# Altium project JacdacTopologyHubEc30 126.PrjPCB
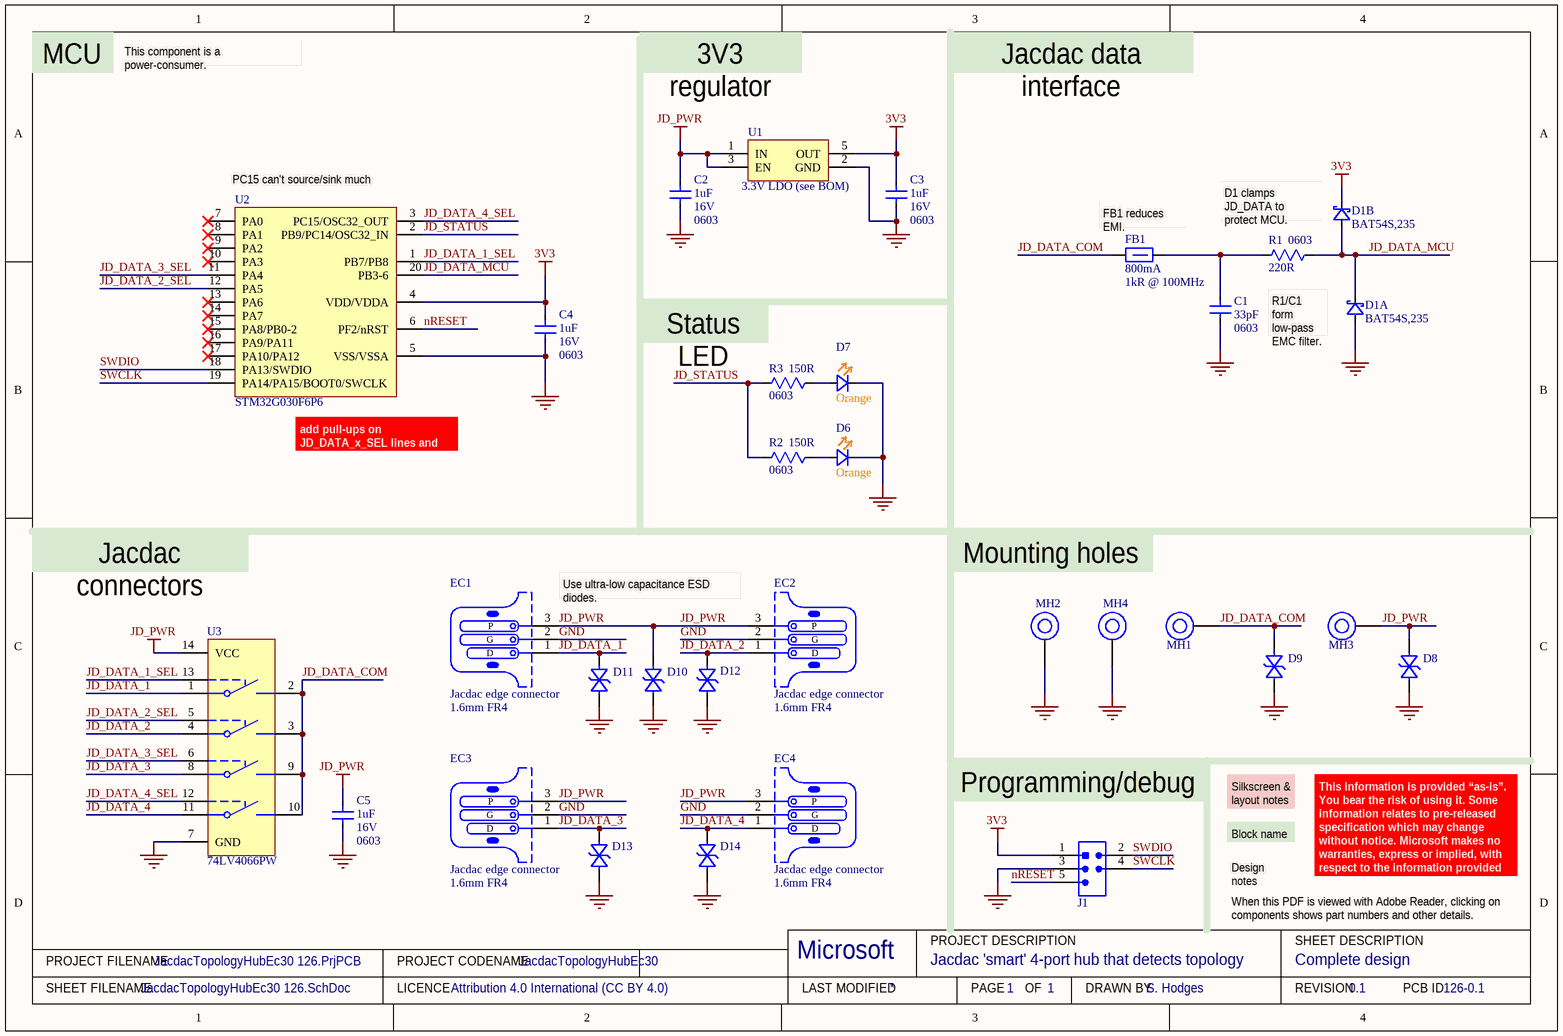
[diagram p0: JacdacTopologyHubEc30 126.SchDoc]
ProjectCodeName: JacdacTopologyHubEc30; ProjectCodenameDescription: Jacdac 'smart' 4-port hub that detects topology; ProjectCodenameID: 126; ProjectDrawnBy: S. Hodges; ProjectLicenceTerms: Attribution 4.0 International (CC BY 4.0); ProjectRevision: 0.1
1 sheet, 31 parts. Net scope: global (net labels, ports and power ports of the same name join across sheets).
Board file: JacdacTopologyHubEc30 126.PcbDoc

## Sheet JacdacTopologyHubEc30 126.SchDoc: Complete design
size A4; DrawnBy: S. Hodges; DocumentNumber: 1; Revision: 0.1; SheetNumber: 1; SheetTotal: 1; VersionControl_RevNumber: 1

### Parts
C1  Case/Package: 0603  [CC0603]  (hidden comment: 33pF)
C2  Voltage: 16V  Case/Package: 0603  Capacitance: 1uF  [C0603 - without outline]  (hidden comment: 1uF 16V)
C3  Voltage: 16V  Case/Package: 0603  Capacitance: 1uF  [C0603 - without outline]  (hidden comment: 1uF 16V)
C4  Voltage: 16V  Case/Package: 0603  Capacitance: 1uF  [C0603 - without outline]  (hidden comment: 1uF 16V)
C5  Voltage: 16V  Case/Package: 0603  Capacitance: 1uF  [C0603 - without outline]  (hidden comment: 1uF 16V)
D1  Manufacturer Part Number: BAT54S,235  [NXP-BAT54S-TO-236AB - without outline]  (hidden comment: BAT54S)  (parts A,B of 2)
D6  Colour: Orange  [0603 Orange]  (hidden comment: 19-217/S2C-AQ1R1B/3T)
D7  Colour: Orange  [0603 Orange]  (hidden comment: 19-217/S2C-AQ1R1B/3T)
D8  RCLAMP0521P-N  [TVS 0402 - XL]  (value not drawn)
D9  RCLAMP0521P-N  [TVS 0402 - XL]  (value not drawn)
D10  RCLAMP0521P-N  [TVS 0402 - XL]  (value not drawn)
D11  RCLAMP0521P-N  [TVS 0402 - XL]  (value not drawn)
D12  RCLAMP0521P-N  [TVS 0402 - XL]  (value not drawn)
D13  RCLAMP0521P-N  [TVS 0402 - XL]  (value not drawn)
D14  RCLAMP0521P-N  [TVS 0402 - XL]  (value not drawn)
EC1  Jacdac edge connector  PCB Type: 1.6mm FR4  [JACDAC_EDGE_CONNECTOR_TRACES_0.15MM]  (no BOM)
EC2  Jacdac edge connector  PCB Type: 1.6mm FR4  [JACDAC_EDGE_CONNECTOR_TRACES_0.15MM]  (no BOM)
EC3  Jacdac edge connector  PCB Type: 1.6mm FR4  [JACDAC_EDGE_CONNECTOR_TRACES_0.15MM]  (no BOM)
EC4  Jacdac edge connector  PCB Type: 1.6mm FR4  [JACDAC_EDGE_CONNECTOR_TRACES_0.15MM]  (no BOM)
FB1  Current Rating: 800mA  Impedance: 1kR @ 100MHz  [TDK MPZ1608 0.8mm - without outline]  (hidden comment: TDK MPZ1608S102ATA00)
J1  Hack Connect Mini 1.27 mm pitch 2-row  [HACK_CONNECT_MINI_5_X_1_27]  (value not drawn)
MH1  MH_6.5MMK_4.5MMC_3.0MMD_PTH  [MH_6.5MMK_4.5MMC_3.0MMD_PTH]  (value not drawn)  (no BOM)
MH2  MH_6.5MMK_4.5MMC_3.0MMD_PTH  [MH_6.5MMK_4.5MMC_3.0MMD_PTH]  (value not drawn)  (no BOM)
MH3  MH_6.5MMK_4.5MMC_3.0MMD_PTH  [MH_6.5MMK_4.5MMC_3.0MMD_PTH]  (value not drawn)  (no BOM)
MH4  MH_6.5MMK_4.5MMC_3.0MMD_PTH  [MH_6.5MMK_4.5MMC_3.0MMD_PTH]  (value not drawn)  (no BOM)
R1  Case/Package: 0603  [RC0603]  (hidden comment: 220R)
R2  Case/Package: 0603  [RC0603]  (hidden comment: 150R)
R3  Case/Package: 0603  [RC0603]  (hidden comment: 150R)
U1  3.3V LDO (see BOM)  [MICRONE-SOT23-5]
U2  STM32G030F6P6  [20-TSSOP - WITHOUT OUTLINE]
U3  (no value)  [TSSOP-14]

### Nets
3V3: C3.2 C4.2 D1.2(K) J1.1(VCC) U1.5(OUT) U2.4(VDD/VDDA)
GND: C1.1 C2.1 C3.1 C4.1 C5.1 D1.1(A) D6.1(K) D7.1(K) D8.2(A) D9.2(A) D10.2(A) D11.2(A) D12.2(A) D13.2(A) D14.2(A) EC1.2(G) EC2.2(G) EC3.2(G) EC4.2(G) J1.3(GND) MH2.1 MH4.1 U1.2(GND) U2.5(VSS/VSSA) U3.7(GND)
JD_PWR: C2.2 C5.2 D8.1(K) D10.1(K) EC1.3(P) EC2.3(P) EC3.3(P) EC4.3(P) MH3.1 U1.1(IN) U1.3(EN) U3.14(VCC)
JD_DATA_1: D11.1(K) EC1.1(D) U3.1(1Y)
JD_DATA_1_SEL: U2.1(PB7/PB8) U3.13(1E)
JD_DATA_2: D12.1(K) EC2.1(D) U3.4(2Y)
JD_DATA_2_SEL: U2.12(PA5) U3.5(2E)
JD_DATA_3: D13.1(K) EC3.1(D) U3.8(3Y)
JD_DATA_3_SEL: U2.11(PA4) U3.6(3E)
JD_DATA_4: D14.1(K) EC4.1(D) U3.11(4Y)
JD_DATA_4_SEL: U2.3(PC15/OSC32_OUT) U3.12(4E)
JD_DATA_COM: D9.1(K) FB1.1 MH1.1 U3.2(1Z) U3.3(2Z) U3.9(3Z) U3.10(4Z)
JD_DATA_MCU: D1.3(K) R1.2 U2.20(PB3-6)
JD_STATUS: R2.1 R3.1 U2.2(PB9/PC14/OSC32_IN)
nRESET: J1.5(RESET) U2.6(PF2/nRST)
SWCLK: J1.4(SWCLK) U2.19(PA14/PA15/BOOT0/SWCLK)
SWDIO: J1.2(SWDIO) U2.18(PA13/SWDIO)
NetC1_2: C1.2 FB1.2 R1.1
NetD6_2: D6.2(A) R2.2
NetD7_2: D7.2(A) R3.2

Not connected (* = marked no-connect by the designer): U2 7(PA0)* 8(PA1)* 9(PA2)* 10(PA3)* 13(PA6)* 14(PA7)* 15(PA8/PB0-2)* 16(PA9/PA11)* 17(PA10/PA12)*

### Notes on the sheet
- MCU
- This component is a power-consumer.
- 3V3 regulator
- Jacdac data interface
- (near U2) PC15 can't source/sink much current
- (near FB1) FB1 reduces EMI.
- D1 clamps JD_DATA to protect MCU.
- (near R3) Status LED
- R1/C1 form low-pass EMC filter.
- (near U2) add pull-ups on JD_DATA_x_SEL lines and check for 5V tolerance
- Jacdac connectors
- Mounting holes
- Use ultra-low capacitance ESD diodes.
- Programming/debug
- Block name
- Silkscreen & layout notes
- Design notes
- When this PDF is viewed with Adobe Reader, clicking on components shows part numbers and other details.
- This information is provided “as-is”. You bear the risk of using it. Some information relates to pre-released specification which may change without notice. Microsoft makes no warranties, express or implied, with respect to the information provided here.
- PROJECT FILENAME
- PROJECT CODENAME
- Microsoft
- PROJECT DESCRIPTION
- SHEET DESCRIPTION
- SHEET FILENAME
- LICENCE
- LAST MODIFIED
- PAGE
- OF
- DRAWN BY
- REVISION
- PCB ID

### Library data of the parts
C1 = CC0603JRNPO9BN330: Cap 33PF 50V 0603 SMD 5% NP0; Manufacturer: Yageo; Dielectric Material: Ceramic; Dielectric: C0G; Temperature Coefficient: 30ppm/°C; Insulation Resistance: 100GR; ComponentLink2URL: https://datasheet.ciiva.com/144/mlccorderingcode-144075.pdf?src-supplier=Digi-Key; ComponentLink2Description: Online part number coding; ComponentLink3URL: https://datasheet.ciiva.com/17434/upy-gphc-x7r-6-3v-to-50v-8-17434263.pdf; ComponentLink3Description: Online datasheet; ComponentLink4URL: https://datasheet.ciiva.com/26829/getdatasheetpartid-403577-26829431.pdf; ComponentLink4Description: Online datasheet; Supplier 1: Digi-Key; Manufacturer Part Number: CC0603JRNPO9BN330; RoHS: Yes; Category: Ceramic Capacitors; Stock 1: 422723; Pricing 1: 4000=0.00888, 8000=0.00811 (USD); Mount: Surface Mount; Number of Pins: 2; Case Code (Metric): 1608; Case Code (Imperial): 0603; Min Operating Temperature: -55°C; Max Operating Temperature: 125°C; Packaging: Tape and Reel; Voltage Rating: 50V; Package Quantity: 1; Voltage Rating (DC): 50V; Termination: SMD/SMT; Resistor Type: Ceramic; Voltage: 50V; Series: CC; Length: 1.6mm; Width: 0.031inch; Height: 0.8mm; Thickness: 0.035inch; Depth: 0.8mm; Radiation Hardening: No; REACH SVHC: No SVHC; Lead Free: Lead Free; RoHS Compliant: Yes; ComponentLink1URL: https://datasheet.ciiva.com/11786/0900766b8079c870-11786082.pdf?src-supplier=RSComponents; ComponentLink1Description: https://datasheet.ciiva.com/11786/0900766b8079c870-11786082.pdf?src-supplier=RSComponents; ComponentLink5URL: https://datasheet.ciiva.com/26862/getdatasheetpartid-403532-26862767.pdf?src-supplier=Verical; ComponentLink5Description: https://datasheet.ciiva.com/26862/getdatasheetpartid-403532-26862767.pdf?src-supplier=Verical; ComponentLink6URL: https://datasheet.ciiva.com/8033/1443161-8033735.pdf?src-supplier=Element14; ComponentLink6Description: https://datasheet.ciiva.com/8033/1443161-8033735.pdf?src-supplier=Element14; ComponentLink7URL: https://datasheet.ciiva.com/7978/1443161-7978142.pdf?src-supplier=Element14; ComponentLink7Description: https://datasheet.ciiva.com/7978/1443161-7978142.pdf?src-supplier=Element14; ComponentLink8URL: https://datasheet.ciiva.com/46430/1835847-46430155.pdf?src-supplier=Element14; ComponentLink8Description: https://datasheet.ciiva.com/46430/1835847-46430155.pdf?src-supplier=Element14; ComponentLink9URL: https://datasheet.ciiva.com/144/mlccorderingcode-144644.pdf?src-supplier=Digi-Key; ComponentLink9Description: https://datasheet.ciiva.com/144/mlccorderingcode-144644.pdf?src-supplier=Digi-Key; ComponentLink10URL: https://datasheet.ciiva.com/144/mlccorderingcode-144643.pdf?src-supplier=Digi-Key; ComponentLink10Description: https://datasheet.ciiva.com/144/mlccorderingcode-144643.pdf?src-supplier=Digi-Key; ComponentLink11URL: https://datasheet.ciiva.com/144/mlccorderingcode-144645.pdf?src-supplier=Digi-Key; ComponentLink11Description: https://datasheet.ciiva.com/144/mlccorderingcode-144645.pdf?src-supplier=Digi-Key; ComponentLink12URL: https://datasheet.ciiva.com/5426/upy-gp-np0-16v-to-50v-8-5426614.pdf?src-supplier=Mouser; ComponentLink12Description: https://datasheet.ciiva.com/5426/upy-gp-np0-16v-to-50v-8-5426614.pdf?src-supplier=Mouser; ComponentLink13URL: https://datasheet.ciiva.com/8033/1372269-8033734.pdf?src-supplier=Element14; ComponentLink13Description: https://datasheet.ciiva.com/8033/1372269-8033734.pdf?src-supplier=Element14; ComponentLink14URL: https://datasheet.ciiva.com/11464/upy-gp-np0-16v-to-50v-8-11464730.pdf?src-supplier=Avnet; ComponentLink14Description: https://datasheet.ciiva.com/11464/upy-gp-np0-16v-to-50v-8-11464730.pdf?src-supplier=Avnet; Supplier 2: Farnell; Supplier 3: RSComponents; Supplier 4: Mouser; Supplier 5: LCSC; Supplier Part Number 5: C107047; Supplier Part Number 4: 603-C0603JRNPO9BN330; Supplier Part Number 3: 2006492; Supplier Part Number 2: 2408499; Supplier Part Number 1: 311-1064-2-ND; Capacitance: 33pF; Tolerance: 5%; Manufacturer Part Number 1: CC0603JRNPO9BN330; Manufacturer 1: Yageo
C2-C5 = CL10A105KO8NNNC: SMD Multilayer Ceramic Capacitor, 1 µF, 16 V, 0603 [1608 Metric], ± 10%, X5R, CL Series; Manufacturer: Samsung; ComponentLink1URL: https://datasheet.lcsc.com/lcsc/1811021622_Samsung-Electro-Mechanics-CL10A105KO8NNNC_C1592.pdfq; ComponentLink1Description: Online datasheet; Supplier 1: Digi-Key; Manufacturer Part Number: CL10A105KO8NNNC; RoHS: Yes; Category: Ceramic Capacitors; Stock 1: 3575337; Pricing 1: 1=0.10000, 10=0.03600, 50=0.01960, 100=0.01600, 500=0.01144, 1000=0.00898 (USD); Mount: Surface Mount; Case Code (Metric): 1608; Case Code (Imperial): 0603; Material: Ceramic; Contact Plating: Tin; Min Operating Temperature: -55°C; Max Operating Temperature: 85°C; Tolerance: 10%; Package Quantity: 1; Packaging: Tape and Reel; Voltage Rating: 16V; Dielectric: X5R; Voltage Rating (DC): 16V; Series: CL; Construction: Flat; Length: 1.6mm; Width: 0.031inch; Height: 0.8mm; Thickness: 0.035inch; Depth: 0.8mm; Radiation Hardening: No; Lead Free: Lead Free; RoHS Compliant: Yes; Supplier 2: Farnell; Supplier 3: RSComponents; Supplier 4: Mouser; Supplier Part Number 1: 1276-1034-1-ND; Supplier Part Number 2: 3013384; Supplier Part Number 3: 7664780; Supplier Part Number 4: 187-CL10A105KO8NNNC; Supplier 5: LCSC; Supplier Part Number 5: C1592; Manufacturer Part Number 1: CL10A105KO8NNNC; Manufacturer 1: Samsung
D1 = BAT54S: DIODE ARRAY SCHOTTKY 30V SOT23; Manufacturer: Nexperia; Supplier 1: Digi-Key; RoHS: No; Category: Rectifier Diodes; Stock 1: 14011; Pricing 1: 1=0.13000, 10=0.11900, 100=0.05610, 500=0.03326, 1000=0.02185, 5000=0.02138 (USD); ComponentLink1URL: https://assets.nexperia.com/documents/data-sheet/BAT54_SER.pdf; ComponentLink1Description: NXP datasheet online; Supplier 2: Mouser; Supplier 3: RSComponents; Supplier Part Number 2: 771-BAT54S235; Supplier Part Number 3: 1707990; Supplier Part Number 1: 1727-1868-1-ND
D6 D7 = 19-217/S2C-AQ1R1B/3T: LED ORANGE DIFFUSED 0603 SMD; Manufacturer: Everlight Elec; Manufacturer Part Number: 19-217/S2C-AQ1R1B/3T; Mount: Surface Mount; Case/Package: 0603; Color: Orange; Case Code (Imperial): 0603; ComponentLink1URL: https://datasheet.lcsc.com/lcsc/1912171731_Everlight-Elec-19-217-S2C-AQ1R1B-3T_C146215.pdf; ComponentLink1Description: Online datasheet; Supplier 1: LCSC; Supplier Part Number 1: C146215; Manufacturer Part Number 1: 19-217/S2C-AQ1R1B/3T; Manufacturer 1: Everlight Elec
D8-D11 = RCLAMP0521P-N: Bidirectional 5V (Max) 6V 16V 3.5A (8/20us) 0402 TVS RoHS; Manufacturer: Born Semiconductor; Package: 0402; Created By: D Gakure; Checked By: ?; Supplier 1: LCSC; Supplier Part Number 1: C316043; ComponentLink1Description: Online datasheet; ComponentLink1URL: https://datasheet.lcsc.com/szlcsc/Bourne-Semicon-Shenzhen-RCLAMP0521P-N_C316043.pdf; Manufacturer Part Number: RCLAMP0521P-N; Manufacturer Part Number 1: RCLAMP0521P-N; Manufacturer 1: Born Semiconductor
D12-D14 = RCLAMP0521P-N: Bidirectional 5V (Max) 6V 16V 3.5A (8/20us) 0402 TVS RoHS; Manufacturer: Born Semiconductor; Manufacturer Part Number: RCLAMP0521 (see BOM); Package: 0402; Created By: D Gakure; Checked By: ?; Supplier 1: LCSC; Supplier Part Number 1: C316043; ComponentLink1Description: Online datasheet; ComponentLink1URL: https://datasheet.lcsc.com/szlcsc/Bourne-Semicon-Shenzhen-RCLAMP0521P-N_C316043.pdf; Manufacturer Part Number 1: RCLAMP0521 (see BOM); Manufacturer 1: Born Semiconductor
EC1-EC4 = Jacdac edge connector: 3 pin Jacdac edge connector 1.27mm pitch; Created By: D. Gakure & S. Hodges; Manufacturer Part Number: n/a; ComponentLink1Description: Yuliang JACDAC cable connector drawing online; ComponentLink1URL: https://github.com/microsoft/jacdac-ddk/tree/main/connector; ComponentLink2Description: JACDAC PCB edge connector spec onlin; ComponentLink2URL: https://github.com/microsoft/jacdac-ddk/tree/main/connector
FB1 = TDK MPZ1608S102ATA00: 0603 1k@100MHz 0.8A chip; Core Material: Ferrite; Tolerance: 25%; DC Resistance (DCR): 300mR; Supplier 1: Digi-Key; Stock 1: 113542; Pricing 1: 1=0.1, 10=0.079, 25=0.0716, 50=0.0644, 100=0.0472, 250=0.03432, 500=0.03146, 1000=0.02717 (USD); Mount: Surface Mount; Case/Package: 0603; Case Code (Metric): 1608; Case Code (Imperial): 0603; Package Quantity: 4000; Packaging: Tape and Reel; Max DC Current: 800mA; Length: 0.063inch; Height: 0.037inch; Width: 0.031inch; ComponentLink2URL: https://www.mouser.co.uk/datasheet/2/400/eads_commercial_power_mpz1608_en-923650.pdf; ComponentLink2Description: datasheet online; Supplier 2: Mouser; ComponentLink3Description: datasheet; ComponentLink3URL: Y:\System\Altium\Libraries 2014\TDK\Datasheets\eads_commercial_power_mpz1608_en-923650.pdf; Supplier Part Number 1: 445-8694-1-ND; Supplier Part Number 2: 810-MPZ1608S102ATA00; Manufacturer: TDK; Manufacturer Part Number: MPZ1608S102ATA00; Manufacturer Part Number 1: MPZ1608S102ATA00; Manufacturer 1: TDK
J1 = HACK_CONNECT_MINI
MH1-MH4 = MH_6.5MMK_4.5MMC_3.0MMD_PTH: Mounting Hole 6.5mm keepout, 4.5mm annualar ring and 3.0mm Drill PTH
R1 = RC0603FR-07220RL: Res Thick Film 0603 220 Ohm 1% 0.1W(1/10W) ±100ppm/°C Pad SMD T/R; Max Power Dissipation: 100mW; Voltage Rating: 50V; Supplier 1: Digi-Key; Manufacturer: = Manufacturer 1; Manufacturer Part Number: = Manufacturer Part Number 1; RoHS: Yes; Category: Chip SMD Resistors; Stock 1: 1257522; Pricing 1: 1=0.10000, 10=0.02300, 100=0.00930, 1000=0.00417, 2500=0.00362 (USD); Number of Pins: 2; Case Code (Imperial): 0603; Case Code (Metric): 1608; Size Code: 0603; Min Operating Temperature: -55°C; Max Operating Temperature: 155°C; Packaging: Tape and Reel; Tolerance: 1%; Resistor Type: Thick Film; Number of Terminations: 2; Temperature Coefficient: 100ppm/°C; Series: RC; Power Rating: 100mW; Package Quantity: 1; Features: Moisture Resistant; Voltage Rating (DC): 50V; Termination: SMD/SMT; Construction: Rectangular; Length: 1.6mm; Width: 0.031inch; Height: 0.022inch; Depth: 0.8mm; RoHS Compliant: Yes; REACH SVHC: No SVHC; Military Standard: Not; Lead Free: Lead Free; Supplier 2: Farnell; Supplier 3: Mouser; Supplier 4: RSComponents; Supplier Part Number 1: 311-220HRCT-ND; Supplier Part Number 3: 603-RC0603FR-07220RL; Supplier Part Number 2: 2421863; Supplier Part Number 4: 1995497; Resistance Tolerance: 1%; Resistance: 220R; Manufacturer Part Number 1: ="Manufacturer Part Number"; Manufacturer 1: ="Manufacturer"; ComponentLink4Description: online datasheet; ComponentLink4URL: https://datasheet.ciiva.com/46395/443971-46395002.pdf
R2 R3 = RC0603FR-07150RL: Res General Purpose Thick Film 0603 150 Ohm 1% 1/10W ±100ppm/°C Molded SMD Paper T/R; Manufacturer: Yageo; Power Rating: 100mW; Voltage Rating (DC): 50V; ComponentLink1URL: https://datasheet.ciiva.com/11819/0900766b80f96399-11819290.pdf; ComponentLink1Description: Online datasheet; Supplier 1: Digi-Key; Manufacturer Part Number: RC0603FR-07150RL; RoHS: Yes; Category: Chip SMD Resistors; Stock 1: 2262542; Pricing 1: 1=0.10000, 10=0.02400, 100=0.00970, 1000=0.00436, 2500=0.00378 (USD); Number of Pins: 2; Case Code (Imperial): 0603; Case Code (Metric): 1608; Size Code: 0603; Min Operating Temperature: -55°C; Max Operating Temperature: 155°C; Tolerance: 1%; Packaging: Tape and Reel; Temperature Coefficient: 100ppm/°C; Voltage Rating: 50V; Package Quantity: 5000; Termination: SMD/SMT; Resistor Type: Thick Film; Features: Moisture Resistant; Series: RC; Max Power Dissipation: 100mW; Number of Terminations: 2; Construction: Rectangular; Length: 1.6mm; Width: 0.8mm; Height: 0.45mm; Depth: 0.8mm; REACH SVHC: No SVHC; Lead Free: Lead Free; Military Standard: Not; RoHS Compliant: Yes; Supplier 2: Farnell; Supplier 3: RSComponents; Supplier 4: Mouser; Supplier Part Number 1: 311-150HRCT-ND; Supplier Part Number 2: 9238387; Supplier Part Number 3: 1995464; Supplier Part Number 4: 603-RC0603FR-07150RL; Supplier 5: LCSC; Supplier Part Number 5: C114608; Resistance Tolerance: 1%; Resistance: 150R; Manufacturer Part Number 1: RC0603FR-07150RL; Manufacturer 1: Yageo
U1 = ME6211C33M5G-N: 6V 260mV @ 200mA(typ) - - Fixed 3.3V SOT-23-5 Linear Voltage Regulators (LDO) ROHS; Manufacturer: MICRONE(Nanjing Micro One Elec); Output Current: 500mA; Output Configuration: Positive; Number of Regulators: 1; Max Input Voltage: 6; Dropout Voltage: 200mV; Supplier Part Number 1: C82942; Category: Voltage Regulators - Linear; Stock 1: 32529; Pricing 1: 1=0.33000, 10=0.24900, 25=0.21760, 100=0.12440, 250=0.11664, 500=0.09330, 1000=0.07153 (USD); Mount: Surface Mount; Case/Package: SOT-23-5; Supplier 1: LCSC; Output Type: Fixed; Min Output Voltage: 3.3V; ComponentLink3URL: https://datasheet.lcsc.com/lcsc/1811131510_MICRONE-Nanjing-Micro-One-Elec-ME6211C33M5G-N_C82942.pdf; ComponentLink3Description: On Semi datasheet online; Created: DG; Checked: ?; Manufacturer Part Number: ME6211C33M5G-N; Manufacturer Part Number 1: ME6211C33M5G-N; Manufacturer 1: MICRONE(Nanjing Micro One Elec)
U2 = STM32G030F6P6: ARM® Cortex®-M0+ series IC 64MHz 32KB 20-TSSOP; Manufacturer 1: STMicroelectronics; Supplier 1: Digi-Key; RoHS: Yes; Category: Microcontrollers; Pricing 1: 1=1.85000, 10=1.65300, 74=1.56905, 148=1.28892, 296=1.20486, 444=1.06475, 962=0.93400 (USD); Supplier 2: Farnell; Supplier 3: Mouser; Supplier Part Number 2: 3294301; Supplier Part Number 1: 497-STM32G030F6P6-ND; Supplier Part Number 3: 511-STM32G030F6P6; ComponentLink1Description: Online datasheet; ComponentLink1URL: https://www.st.com/resource/en/datasheet/stm32g030f6.pdf; ComponentLink2Description: Online reference manual; ComponentLink2URL: https://www.st.com/resource/en/reference_manual/rm0454-stm32g0x0-advanced-armbased-32bit-mcus-stmicroelectronics.pdf; Manufacturer Part Number 1: STM32G030F6P6; RoHS Compliant: Yes; Supplier 10: LCSC; Supplier Part Number 10: C724040
U3 = 74LV4066PW: 74LV Series 3.3 V SMT CMOS Low On Resistance Quad Bilateral Switch - TSSOP-14; Manufacturer 1: Nexperia USA; ComponentLink1URL: https://assets.nexperia.com/documents/data-sheet/74LV4066.pdf; ComponentLink1Description: Online datasheet; Supplier 1: Digi-Key; RoHS: No; Supplier Part Number 1: 1727-6665-1-ND; Manufacturer Part Number 1: 74LV4066PW